# EAGLE schematic Break_out (EAGLE 9.6.2)
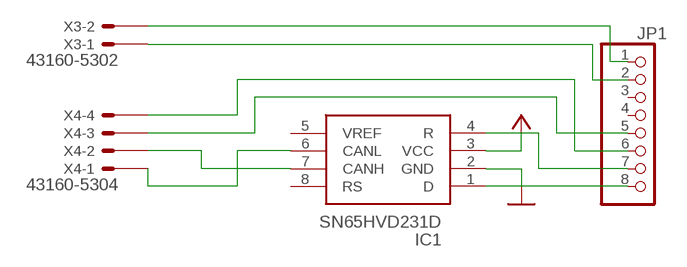
[diagram p0: schematic, sheet 1]

## Parts
IC1  SN65HVD231D  [SOIC127P600X175-8N]
JP1  PINHD-1X8BIG  [1X08-BIG]
X3  43160-5302  [43160-XX02]
X4  43160-5304  [43160-XX04]

## Nets
GND: IC1.2(GND)
N$1: IC1.1(D) JP1.8
N$2: IC1.4(R) JP1.7
N$3: IC1.7(CANH) X4.2@1(-2:S)
N$4: IC1.6(CANL) X4.1@1(-1:S)
N$5: JP1.5 X4.3@1(-3:S)
N$6: JP1.6 X4.4@1(-4:S)
N$7: JP1.2 X3.1@1(-1:S)
N$8: JP1.1 X3.2@1(-2:S)
VCC: IC1.3(VCC)
Unconnected: IC1.5(VREF) IC1.8(RS) JP1.3 JP1.4 X3.1@2(-1:S) X3.2@2(-2:S) X4.1@2(-1:S) X4.2@2(-2:S) X4.3@2(-3:S) X4.4@2(-4:S)

## Library data of the parts
IC1 = SN65HVD231D:SN65HVD231D: CAN Transceiver 1Mbit/s ISO 11898, Sleep-Mode, 8-Pin SOIC Source: Datasheet <http://www.ti.com/lit/ds/symlink/sn65hvd230.pdf>; ARROW_PART_NUMBER: SN65HVD231D; ARROW_PRICE-STOCK: https://www.arrow.com/en/products/sn65hvd231d/texas-instruments?region=nac; DESCRIPTION: CAN Transceiver 1Mbit/s ISO 11898, Sleep-Mode, 8-Pin SOIC; HEIGHT: 1.75mm; MANUFACTURER_NAME: Texas Instruments; MANUFACTURER_PART_NUMBER: SN65HVD231D; MOUSER_PART_NUMBER: 595-SN65HVD231D; MOUSER_PRICE-STOCK: https://www.mouser.co.uk/ProductDetail/Texas-Instruments/SN65HVD231D?qs=QViXGNcIEAsYeC9x726Emw%3D%3D
JP1 = adafruit:PINHD-1X8: PIN HEADER
X3 = con-molex:43160-*02: SDA-43160 Connector Source: http://www.molex.com/pdm_docs/sd/431601306_sd.pdf; MF: MOLEX; MPN: 43160-5302; OC_FARNELL: unknown; OC_NEWARK: 92M1498
X4 = con-molex:43160-*04: SDA-43160 Connector Source: http://www.molex.com/pdm_docs/sd/431601306_sd.pdf; MF: MOLEX; MPN: 43160-5304; OC_FARNELL: unknown; OC_NEWARK: 92M1500